# EAGLE schematic bc-module-breadboard (EAGLE 7.7.0)
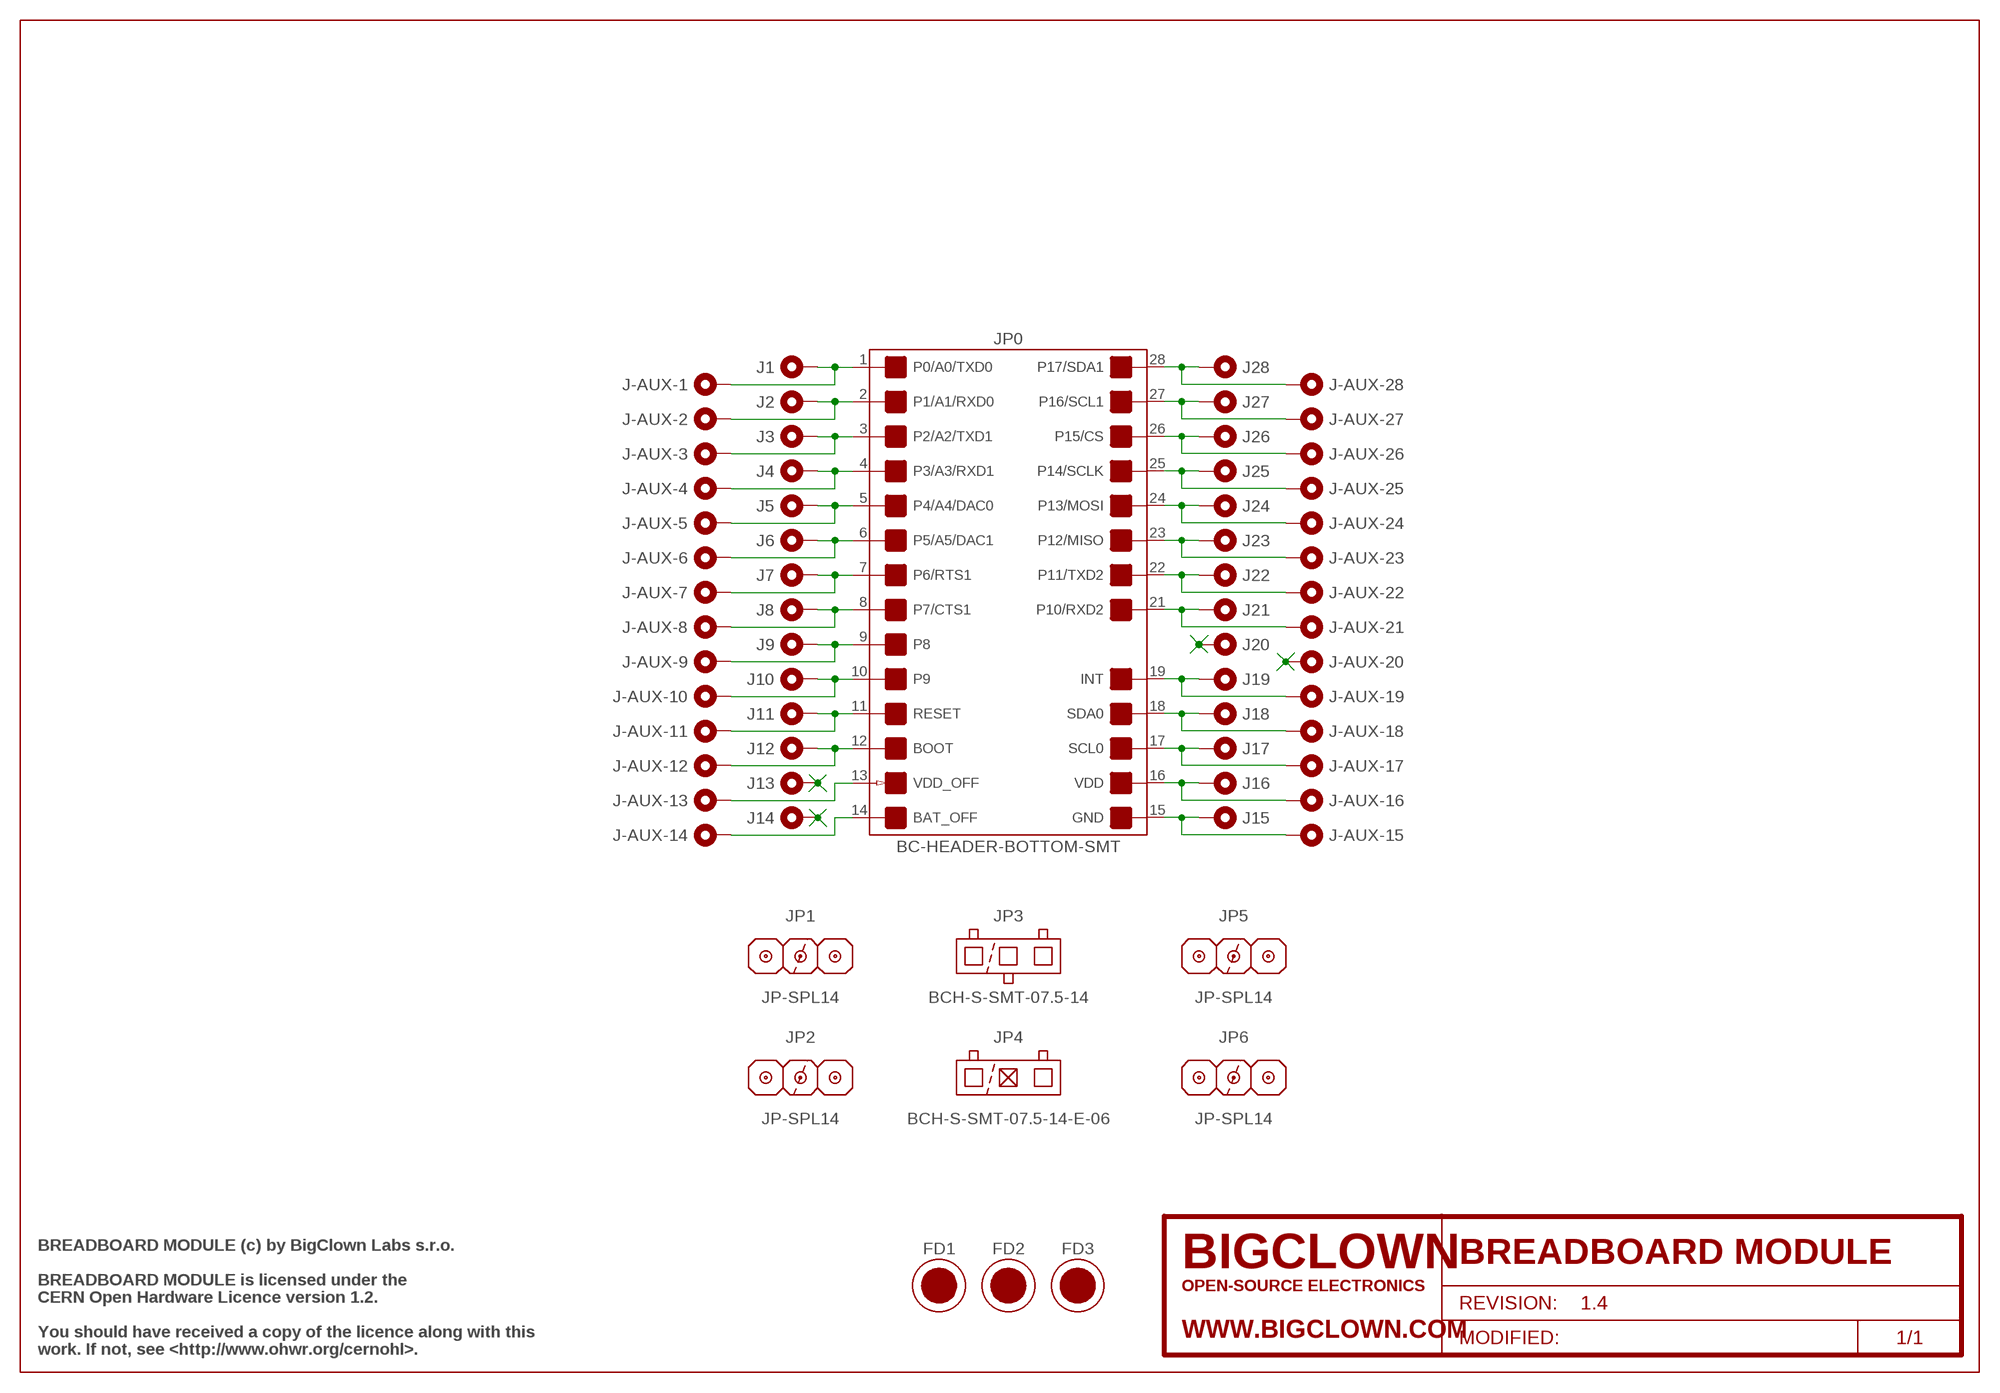
[diagram p0: schematic, sheet 1]

## Parts
FD1  FIDUCIAL  [FIDUCIAL-1MM]
FD2  FIDUCIAL  [FIDUCIAL-1MM]
FD3  FIDUCIAL  [FIDUCIAL-1MM]
FRAME1  FRAME-SCH/A4L-BRD/A4L  [FRAME-A4L]
J1  BC-HEADER-PIN-PRECISION-THT  [BC-HEADER-PIN-PRECISION-THT]
J2  BC-HEADER-PIN-PRECISION-THT  [BC-HEADER-PIN-PRECISION-THT]
J3  BC-HEADER-PIN-PRECISION-THT  [BC-HEADER-PIN-PRECISION-THT]
J4  BC-HEADER-PIN-PRECISION-THT  [BC-HEADER-PIN-PRECISION-THT]
J5  BC-HEADER-PIN-PRECISION-THT  [BC-HEADER-PIN-PRECISION-THT]
J6  BC-HEADER-PIN-PRECISION-THT  [BC-HEADER-PIN-PRECISION-THT]
J7  BC-HEADER-PIN-PRECISION-THT  [BC-HEADER-PIN-PRECISION-THT]
J8  BC-HEADER-PIN-PRECISION-THT  [BC-HEADER-PIN-PRECISION-THT]
J9  BC-HEADER-PIN-PRECISION-THT  [BC-HEADER-PIN-PRECISION-THT]
J10  BC-HEADER-PIN-PRECISION-THT  [BC-HEADER-PIN-PRECISION-THT]
J11  BC-HEADER-PIN-PRECISION-THT  [BC-HEADER-PIN-PRECISION-THT]
J12  BC-HEADER-PIN-PRECISION-THT  [BC-HEADER-PIN-PRECISION-THT]
J13  BC-HEADER-PIN-PRECISION-THT  [BC-HEADER-PIN-PRECISION-THT]
J14  BC-HEADER-PIN-PRECISION-THT  [BC-HEADER-PIN-PRECISION-THT]
J15  BC-HEADER-PIN-PRECISION-THT  [BC-HEADER-PIN-PRECISION-THT]
J16  BC-HEADER-PIN-PRECISION-THT  [BC-HEADER-PIN-PRECISION-THT]
J17  BC-HEADER-PIN-PRECISION-THT  [BC-HEADER-PIN-PRECISION-THT]
J18  BC-HEADER-PIN-PRECISION-THT  [BC-HEADER-PIN-PRECISION-THT]
J19  BC-HEADER-PIN-PRECISION-THT  [BC-HEADER-PIN-PRECISION-THT]
J20  BC-HEADER-PIN-PRECISION-THT  [BC-HEADER-PIN-PRECISION-THT]
J21  BC-HEADER-PIN-PRECISION-THT  [BC-HEADER-PIN-PRECISION-THT]
J22  BC-HEADER-PIN-PRECISION-THT  [BC-HEADER-PIN-PRECISION-THT]
J23  BC-HEADER-PIN-PRECISION-THT  [BC-HEADER-PIN-PRECISION-THT]
J24  BC-HEADER-PIN-PRECISION-THT  [BC-HEADER-PIN-PRECISION-THT]
J25  BC-HEADER-PIN-PRECISION-THT  [BC-HEADER-PIN-PRECISION-THT]
J26  BC-HEADER-PIN-PRECISION-THT  [BC-HEADER-PIN-PRECISION-THT]
J27  BC-HEADER-PIN-PRECISION-THT  [BC-HEADER-PIN-PRECISION-THT]
J28  BC-HEADER-PIN-PRECISION-THT  [BC-HEADER-PIN-PRECISION-THT]
J-AUX-1  BC-HEADER-PIN-PRECISION-THT  [BC-HEADER-PIN-PRECISION-THT]
J-AUX-2  BC-HEADER-PIN-PRECISION-THT  [BC-HEADER-PIN-PRECISION-THT]
J-AUX-3  BC-HEADER-PIN-PRECISION-THT  [BC-HEADER-PIN-PRECISION-THT]
J-AUX-4  BC-HEADER-PIN-PRECISION-THT  [BC-HEADER-PIN-PRECISION-THT]
J-AUX-5  BC-HEADER-PIN-PRECISION-THT  [BC-HEADER-PIN-PRECISION-THT]
J-AUX-6  BC-HEADER-PIN-PRECISION-THT  [BC-HEADER-PIN-PRECISION-THT]
J-AUX-7  BC-HEADER-PIN-PRECISION-THT  [BC-HEADER-PIN-PRECISION-THT]
J-AUX-8  BC-HEADER-PIN-PRECISION-THT  [BC-HEADER-PIN-PRECISION-THT]
J-AUX-9  BC-HEADER-PIN-PRECISION-THT  [BC-HEADER-PIN-PRECISION-THT]
J-AUX-10  BC-HEADER-PIN-PRECISION-THT  [BC-HEADER-PIN-PRECISION-THT]
J-AUX-11  BC-HEADER-PIN-PRECISION-THT  [BC-HEADER-PIN-PRECISION-THT]
J-AUX-12  BC-HEADER-PIN-PRECISION-THT  [BC-HEADER-PIN-PRECISION-THT]
J-AUX-13  BC-HEADER-PIN-PRECISION-THT  [BC-HEADER-PIN-PRECISION-THT]
J-AUX-14  BC-HEADER-PIN-PRECISION-THT  [BC-HEADER-PIN-PRECISION-THT]
J-AUX-15  BC-HEADER-PIN-PRECISION-THT  [BC-HEADER-PIN-PRECISION-THT]
J-AUX-16  BC-HEADER-PIN-PRECISION-THT  [BC-HEADER-PIN-PRECISION-THT]
J-AUX-17  BC-HEADER-PIN-PRECISION-THT  [BC-HEADER-PIN-PRECISION-THT]
J-AUX-18  BC-HEADER-PIN-PRECISION-THT  [BC-HEADER-PIN-PRECISION-THT]
J-AUX-19  BC-HEADER-PIN-PRECISION-THT  [BC-HEADER-PIN-PRECISION-THT]
J-AUX-20  BC-HEADER-PIN-PRECISION-THT  [BC-HEADER-PIN-PRECISION-THT]
J-AUX-21  BC-HEADER-PIN-PRECISION-THT  [BC-HEADER-PIN-PRECISION-THT]
J-AUX-22  BC-HEADER-PIN-PRECISION-THT  [BC-HEADER-PIN-PRECISION-THT]
J-AUX-23  BC-HEADER-PIN-PRECISION-THT  [BC-HEADER-PIN-PRECISION-THT]
J-AUX-24  BC-HEADER-PIN-PRECISION-THT  [BC-HEADER-PIN-PRECISION-THT]
J-AUX-25  BC-HEADER-PIN-PRECISION-THT  [BC-HEADER-PIN-PRECISION-THT]
J-AUX-26  BC-HEADER-PIN-PRECISION-THT  [BC-HEADER-PIN-PRECISION-THT]
J-AUX-27  BC-HEADER-PIN-PRECISION-THT  [BC-HEADER-PIN-PRECISION-THT]
J-AUX-28  BC-HEADER-PIN-PRECISION-THT  [BC-HEADER-PIN-PRECISION-THT]
JP0  BC-HEADER-BOTTOM-SMT  [BC-HEADER-BOTTOM-SMT]
JP1  JP-SPL14  [JP-SPL14]
JP2  JP-SPL14  [JP-SPL14]
JP3  BCH-S-SMT-07.5-14  JP-BCH-S-SMT-07.5-14  [BCH-S-SMT-14]
JP4  BCH-S-SMT-07.5-14-E-06  JP-BCH-S-SMT-07.5-14-E-06  [BCH-S-SMT-14-E-06]
JP5  JP-SPL14  [JP-SPL14]
JP6  JP-SPL14  [JP-SPL14]

## Nets
BAT_OFF: J-AUX-14.0 JP0.14(BAT_OFF)
BOOT: J12.0 J-AUX-12.0 JP0.12(BOOT)
GND: J15.0 J-AUX-15.0 JP0.15(GND)
INT: J19.0 J-AUX-19.0 JP0.19(INT)
J13_NC: J13.0
J14_NC: J14.0
J20_NC: J20.0
J-AUX-20_NC: J-AUX-20.0
P0/A0/TXD0: J1.0 J-AUX-1.0 JP0.1(P0/A0/TXD0)
P1/A1/RXD0: J2.0 J-AUX-2.0 JP0.2(P1/A1/RXD0)
P2/A2/TXD1: J3.0 J-AUX-3.0 JP0.3(P2/A2/TXD1)
P3/A3/RXD1: J4.0 J-AUX-4.0 JP0.4(P3/A3/RXD1)
P4/A4/DAC0: J5.0 J-AUX-5.0 JP0.5(P4/A4/DAC0)
P5/A5/DAC1: J6.0 J-AUX-6.0 JP0.6(P5/A5/DAC1)
P6/RTS1: J7.0 J-AUX-7.0 JP0.7(P6/RTS1)
P7T/CTS1: J8.0 J-AUX-8.0 JP0.8(P7/CTS1)
P8: J9.0 J-AUX-9.0 JP0.9(P8)
P9: J10.0 J-AUX-10.0 JP0.10(P9)
P10/RXD2: J21.0 J-AUX-21.0 JP0.21(P10/RXD2)
P11/TXD2: J22.0 J-AUX-22.0 JP0.22(P11/TXD2)
P12/MISO: J23.0 J-AUX-23.0 JP0.23(P12/MISO)
P13/MOSI: J24.0 J-AUX-24.0 JP0.24(P13/MOSI)
P14/SCLK: J25.0 J-AUX-25.0 JP0.25(P14/SCLK)
P15/CS: J26.0 J-AUX-26.0 JP0.26(P15/CS)
P16/SCL1: J27.0 J-AUX-27.0 JP0.27(P16/SCL1)
P17/SDA1: J28.0 J-AUX-28.0 JP0.28(P17/SDA1)
RESET: J11.0 J-AUX-11.0 JP0.11(RESET)
SCL0: J17.0 J-AUX-17.0 JP0.17(SCL0)
SDA0: J18.0 J-AUX-18.0 JP0.18(SDA0)
VDD: J16.0 J-AUX-16.0 JP0.16(VDD)
VDD_OFF: J-AUX-13.0 JP0.13(VDD_OFF_IN)

## Notes on the sheet
- BREADBOARD MODULE (c) by BigClown Labs s.r.o.
- BREADBOARD MODULE is licensed under the
- CERN Open Hardware Licence version 1.2.
- You should have received a copy of the licence along with this
- work. If not, see <http://www.ohwr.org/cernohl>.

## Library data of the parts
FD1-FD3 = bc-fiducial:FIDUCIAL; BCPN: -
FRAME1 = bc-frame:FRAME-SCH/A4L-BRD/A4L; BCPN: -; PROJECT_NAME: BREADBOARD MODULE; PROJECT_REVISION: 1.4
J1-J28 J-AUX-1-J-AUX-28 = bc-header:BC-HEADER-PIN-PRECISION-THT; BCPN: -
JP0 = bc-header:BC-HEADER-BOTTOM-SMT; BCPN: -
JP1 JP2 JP5 JP6 = bc-header:JP-SPL14; BCPN: BC-JP-SPL14
JP3 = bc-header:JP-BCH-S-SMT-07.5-14; BCPN: BC-JP-BCH-S-SMT-07.5-14
JP4 = bc-header:JP-BCH-S-SMT-07.5-14-E-06; BCPN: BC-JP-BCH-S-SMT-07.5-14-E-06